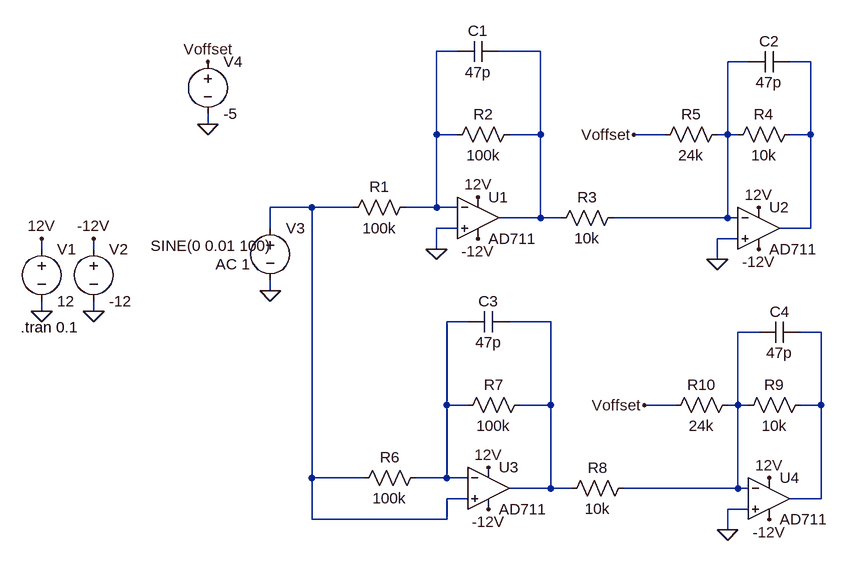
[diagram p0: schematic attenuverter.asc]
attenuverter.asc, the LTspice schematic file:
Version 4
SHEET 1 880 692
WIRE 160 -128 128 -128
WIRE 288 -128 224 -128
WIRE 608 -112 576 -112
WIRE 704 -112 672 -112
WIRE -224 -16 -224 -32
WIRE 128 0 128 -128
WIRE 160 0 128 0
WIRE 288 0 288 -128
WIRE 288 0 240 0
WIRE 480 0 432 0
WIRE 576 0 576 -112
WIRE 576 0 560 0
WIRE 592 0 576 0
WIRE 704 0 704 -112
WIRE 704 0 672 0
WIRE -64 112 -128 112
WIRE 0 112 -64 112
WIRE 128 112 128 0
WIRE 128 112 80 112
WIRE 160 112 128 112
WIRE 288 128 288 0
WIRE 288 128 224 128
WIRE 320 128 288 128
WIRE 576 128 576 0
WIRE 576 128 400 128
WIRE 592 128 576 128
WIRE -128 144 -128 112
WIRE 160 144 128 144
WIRE 704 144 704 0
WIRE 704 144 656 144
WIRE 592 160 560 160
WIRE -480 176 -480 160
WIRE -400 176 -400 160
WIRE 128 176 128 144
WIRE 560 192 560 160
WIRE -128 240 -128 224
WIRE -480 272 -480 256
WIRE -400 272 -400 256
WIRE 176 288 144 288
WIRE 304 288 240 288
WIRE 624 304 592 304
WIRE 720 304 688 304
WIRE 144 416 144 288
WIRE 176 416 144 416
WIRE 304 416 304 288
WIRE 304 416 256 416
WIRE 496 416 448 416
WIRE 592 416 592 304
WIRE 592 416 576 416
WIRE 608 416 592 416
WIRE 720 416 720 304
WIRE 720 416 688 416
WIRE -64 528 -64 112
WIRE 16 528 -64 528
WIRE 144 528 144 416
WIRE 144 528 96 528
WIRE 176 528 144 528
WIRE 304 544 304 416
WIRE 304 544 240 544
WIRE 336 544 304 544
WIRE 592 544 592 416
WIRE 592 544 416 544
WIRE 608 544 592 544
WIRE 176 560 144 560
WIRE 720 560 720 416
WIRE 720 560 672 560
WIRE 608 576 576 576
WIRE -64 592 -64 528
WIRE 144 592 144 560
WIRE 144 592 -64 592
WIRE 576 608 576 576
FLAG -480 272 0
FLAG -400 272 0
FLAG -400 160 -12V
FLAG -480 160 12V
FLAG -128 240 0
FLAG 128 176 0
FLAG 192 160 -12V
FLAG 192 96 12V
FLAG 624 176 -12V
FLAG 624 112 12V
FLAG 560 192 0
FLAG -224 -16 0
FLAG -224 -112 Voffset
FLAG 432 0 Voffset
FLAG 208 576 -12V
FLAG 208 512 12V
FLAG 640 592 -12V
FLAG 640 528 12V
FLAG 576 608 0
FLAG 448 416 Voffset
SYMBOL res 96 96 R90
WINDOW 0 0 56 VBottom 2
WINDOW 3 32 56 VTop 2
SYMATTR InstName R1
SYMATTR Value 100k
SYMBOL res 256 -16 R90
WINDOW 0 0 56 VBottom 2
WINDOW 3 32 56 VTop 2
SYMATTR InstName R2
SYMATTR Value 100k
SYMBOL cap 224 -144 R90
WINDOW 0 0 32 VBottom 2
WINDOW 3 32 32 VTop 2
SYMATTR InstName C1
SYMATTR Value 47p
SYMBOL OpAmps\\AD711 192 64 R0
SYMATTR InstName U1
SYMBOL voltage -480 160 R0
WINDOW 123 0 0 Left 0
WINDOW 39 0 0 Left 0
SYMATTR InstName V1
SYMATTR Value 12
SYMBOL voltage -400 160 R0
WINDOW 123 0 0 Left 0
WINDOW 39 0 0 Left 0
SYMATTR InstName V2
SYMATTR Value -12
SYMBOL voltage -128 128 R0
WINDOW 3 -184 43 Left 2
WINDOW 123 -84 71 Left 2
WINDOW 39 0 0 Left 0
SYMATTR Value SINE(0 0.01 100)
SYMATTR Value2 AC 1
SYMATTR InstName V3
SYMBOL OpAmps\\AD711 624 80 R0
SYMATTR InstName U2
SYMBOL res 416 112 R90
WINDOW 0 0 56 VBottom 2
WINDOW 3 32 56 VTop 2
SYMATTR InstName R3
SYMATTR Value 10k
SYMBOL res 688 -16 R90
WINDOW 0 0 56 VBottom 2
WINDOW 3 32 56 VTop 2
SYMATTR InstName R4
SYMATTR Value 10k
SYMBOL cap 672 -128 R90
WINDOW 0 0 32 VBottom 2
WINDOW 3 32 32 VTop 2
SYMATTR InstName C2
SYMATTR Value 47p
SYMBOL res 576 -16 R90
WINDOW 0 0 56 VBottom 2
WINDOW 3 32 56 VTop 2
SYMATTR InstName R5
SYMATTR Value 24k
SYMBOL voltage -224 -128 R0
WINDOW 123 0 0 Left 0
WINDOW 39 0 0 Left 0
SYMATTR InstName V4
SYMATTR Value -5
SYMBOL res 112 512 R90
WINDOW 0 0 56 VBottom 2
WINDOW 3 32 56 VTop 2
SYMATTR InstName R6
SYMATTR Value 100k
SYMBOL res 272 400 R90
WINDOW 0 0 56 VBottom 2
WINDOW 3 32 56 VTop 2
SYMATTR InstName R7
SYMATTR Value 100k
SYMBOL cap 240 272 R90
WINDOW 0 0 32 VBottom 2
WINDOW 3 32 32 VTop 2
SYMATTR InstName C3
SYMATTR Value 47p
SYMBOL OpAmps\\AD711 208 480 R0
SYMATTR InstName U3
SYMBOL OpAmps\\AD711 640 496 R0
SYMATTR InstName U4
SYMBOL res 432 528 R90
WINDOW 0 0 56 VBottom 2
WINDOW 3 32 56 VTop 2
SYMATTR InstName R8
SYMATTR Value 10k
SYMBOL res 704 400 R90
WINDOW 0 0 56 VBottom 2
WINDOW 3 32 56 VTop 2
SYMATTR InstName R9
SYMATTR Value 10k
SYMBOL cap 688 288 R90
WINDOW 0 0 32 VBottom 2
WINDOW 3 32 32 VTop 2
SYMATTR InstName C4
SYMATTR Value 47p
SYMBOL res 592 400 R90
WINDOW 0 0 56 VBottom 2
WINDOW 3 32 56 VTop 2
SYMATTR InstName R10
SYMATTR Value 24k
TEXT -512 296 Left 2 !.tran 0.1

The netlist it stands for:
* attenuverter.asc
R1 N001 N005 100k
R2 N002 N001 100k
C1 N002 N001 47p
XU1 0 N001 12V -12V N002 AD712  ; AD711, pins In+ In- V+ V- OUT
V1 12V 0 12
V2 -12V 0 -12
V3 N005 0 SINE(0 0.01 100) AC 1
XU2 0 N003 12V -12V N004 AD712  ; AD711, pins In+ In- V+ V- OUT
R3 N003 N002 10k
R4 N004 N003 10k
C2 N004 N003 47p
R5 N003 Voffset 24k
V4 Voffset 0 -5
R6 N006 N005 100k
R7 N007 N006 100k
C3 N007 N006 47p
XU3 N005 N006 12V -12V N007 AD712  ; AD711, pins In+ In- V+ V- OUT
XU4 0 N008 12V -12V N009 AD712  ; AD711, pins In+ In- V+ V- OUT
R8 N008 N007 10k
R9 N009 N008 10k
C4 N009 N008 47p
R10 N008 Voffset 24k
.tran 0.1
.lib ADI1.lib
.backanno
.end